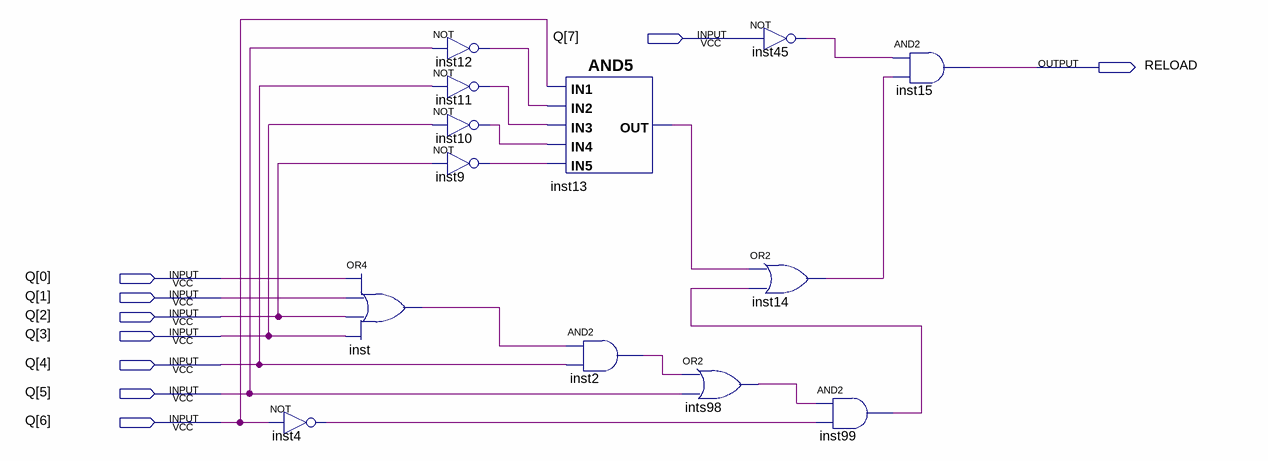
[diagram p0: schematic sheet]
// Quartus schematic Def.bdf as structural Verilog: 13 symbols, 9 pins
module Def (
  input  [7:0] Q,
  output RELOAD
);

  wire inst2_out, inst4_out, inst9_out, inst10_out, inst11_out, inst12_out, inst13_out, inst14_out,
       inst45_out, inst99_out, inst_out, ints98_out;

  not inst4 (inst4_out, Q[6]);
  or inst (inst_out, Q[0], Q[1], Q[2], Q[3]);
  not inst12 (inst12_out, Q[5]);
  not inst11 (inst11_out, Q[4]);
  not inst10 (inst10_out, Q[3]);
  not inst9 (inst9_out, Q[2]);
  and inst13 (inst13_out, Q[6], inst12_out, inst11_out, inst10_out, inst9_out);
  and inst2 (inst2_out, inst_out, Q[4]);
  or ints98 (ints98_out, inst2_out, Q[5]);
  not inst45 (inst45_out, Q[7]);
  or inst14 (inst14_out, inst13_out, inst99_out);
  and inst99 (inst99_out, ints98_out, inst4_out);
  and inst15 (RELOAD, inst45_out, inst14_out);
endmodule
